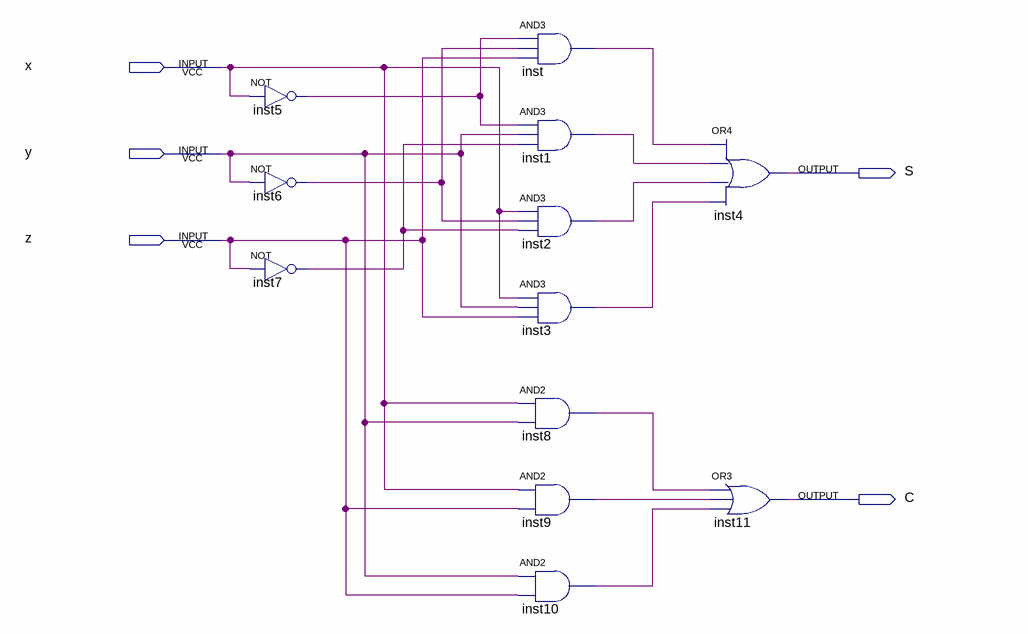
[diagram p0: schematic sheet]
// Quartus schematic FullAdder.bdf as structural Verilog: 12 symbols, 5 pins
module FullAdder (
  input  x,
  input  y,
  input  z,
  output S,
  output C
);

  wire inst1_out, inst2_out, inst3_out, inst5_out, inst6_out, inst7_out, inst8_out, inst9_out, inst10_out,
       inst_out;

  not inst5 (inst5_out, x);
  not inst6 (inst6_out, y);
  not inst7 (inst7_out, z);
  and inst (inst_out, inst5_out, inst6_out, z);
  and inst1 (inst1_out, inst5_out, y, inst7_out);
  and inst2 (inst2_out, x, inst6_out, inst7_out);
  and inst3 (inst3_out, x, y, z);
  and inst8 (inst8_out, x, y);
  and inst9 (inst9_out, x, z);
  and inst10 (inst10_out, y, z);
  or inst4 (S, inst_out, inst1_out, inst2_out, inst3_out);
  or inst11 (C, inst8_out, inst9_out, inst10_out);
endmodule
